# Altium schematic sheet v1.5 Solar.SchDoc
size A4; DocumentNumber: 1; SheetNumber: 1
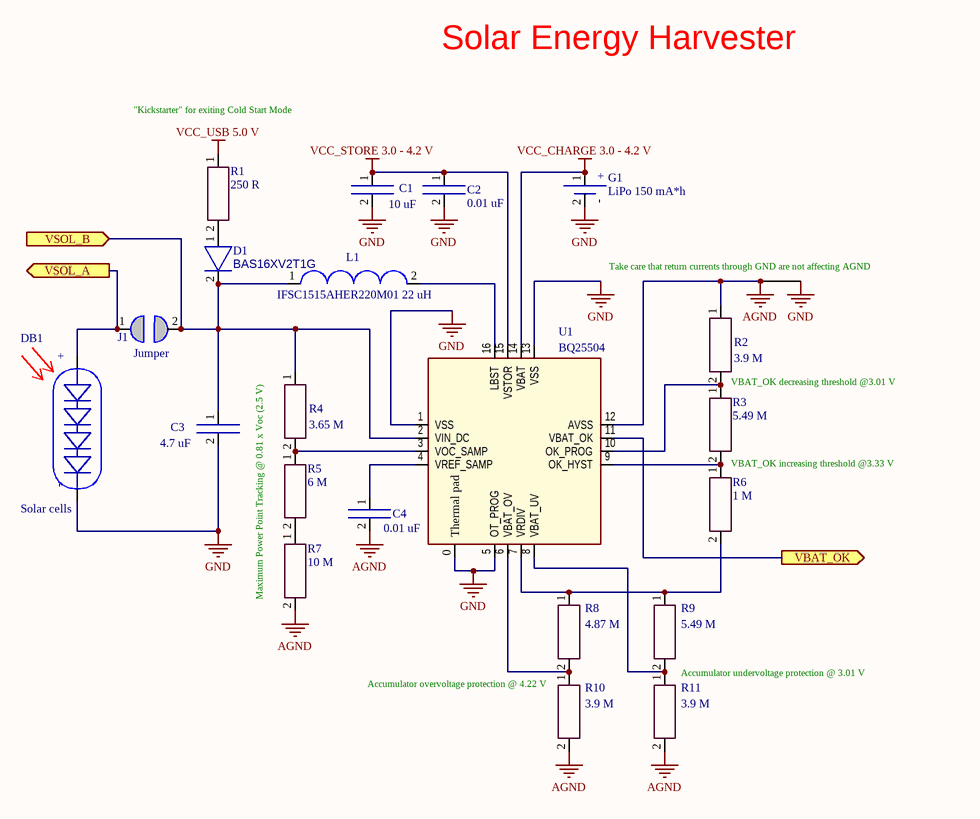
[diagram p0: v1.5 Solar.SchDoc]

## Parts
C1  10 uF  [0603]
C2  0.01 uF  [0402]
C3  4.7 uF  [0402]
C4  0.01 uF  [0402]
D1  BAS16XV2T1G  [SOD-523]
DB1  Solar cells  [Solar cells]  (no BOM)
G1  LiPo 150 mA*h  [LPV551230]  (no BOM)
J1  Jumper  [0603 - Jumper]  (no BOM)
L1  IFSC1515AHER220M01 22 uH  [IFSC1515-AH-01]
NET_TIE1  (no value)  [Net Tie]  (net tie, no BOM)
R1  250 R  [0402]
R2  3.9 M  [0402]
R3  5.49 M  [0402]
R4  3.65 M  [0402]
R5  6 M  [0402]
R6  1 M  [0402]
R7  10 M  [0402]
R8  4.87 M  [0402]
R9  5.49 M  [0402]
R10  3.9 M  [0402]
R11  3.9 M  [0402]
U1  BQ25504  [BQ25504]

## Ports
VBAT_OK (out), VSOL_A (out), VSOL_B (in)

## Nets
AGND: C4.2 NET_TIE1.1 R2.1 R7.2 R10.2 R11.2 U1.12(AVSS)
GND: C1.2 C2.2 C3.2 G1.2 NET_TIE1.2 U1.0(Thermal_pad) U1.1(VSS) U1.5(OT_PROG) U1.13(VSS)
VCC_CHARGE 3.0 - 4.2 V: G1.1 U1.14(VBAT)
VCC_STORE 3.0 - 4.2 V: C1.1 C2.1 U1.15(VSTOR)
VCC_USB 5.0 V: R1.1
VBAT_OK: U1.11(VBAT_OK) ; port VBAT_OK
VSOL_A: J1.1 ; port VSOL_A
VSOL_B: C3.1 D1.2 J1.2 L1.1 R4.1 U1.2(VIN_DC) ; port VSOL_B
NetC4_1: C4.1 U1.4(VREF_SAMP)
NetD1_1: D1.1 R1.2
NetL1_2: L1.2 U1.16(LBST)
NetR2_2: R2.2 R3.1 U1.10(OK_PROG)
NetR3_2: R3.2 R6.1 U1.9(OK_HYST)
NetR4_2: R4.2 R5.1 U1.3(VOC_SAMP)
NetR5_2: R5.2 R7.1
NetR6_2: R6.2 R8.1 R9.1 U1.7(VRDIV)
NetR8_2: R8.2 R10.1 U1.6(VBAT_OV)
NetR9_2: R9.2 R11.1 U1.8(VBAT_UV)

## Notes on the sheet
- Solar Energy Harvester
- (near R1) "Kickstarter" for exiting Cold Start Mode
- (near NET_TIE1) Take care that return currents through GND are not affecting AGND
- VBAT_OK decreasing threshold @3.01 V
- VBAT_OK increasing threshold @3.33 V
- Maximum Power Point Tracking @ 0.81 x Voc (2.5 V)
- (near R10) Accumulator overvoltage protection @ 4.22 V
- Accumulator undervoltage protection @ 3.01 V
- (in symbol Accumulator) +; -
- (in symbol Solar cells) +; -

## Library data of the parts
C1-C4 = Capasistor
D1 = Diode
G1 = Accumulator
L1 = Inductor
NET_TIE1 = Net Tie
R1-R11 = Resistor